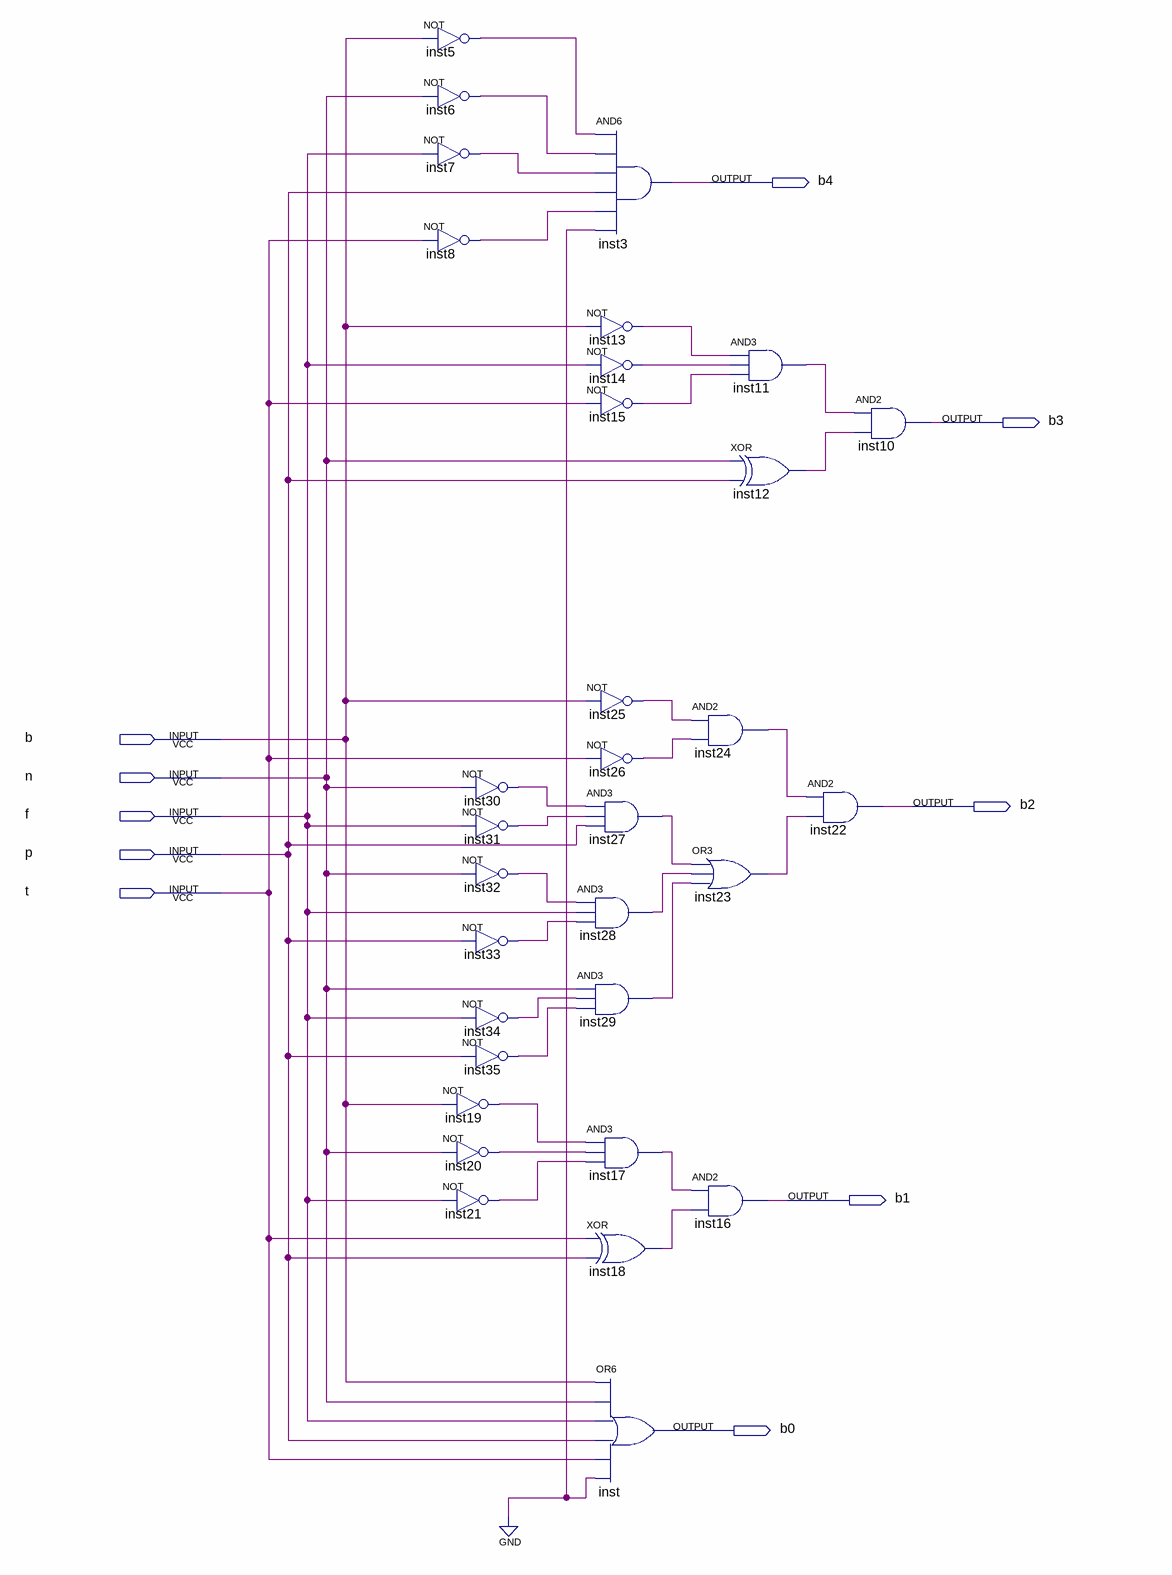
[diagram p0: schematic sheet]
// Quartus schematic Selector_7_segmentos.bdf as structural Verilog: 32 symbols, 10 pins
module Selector_7_segmentos (
  input  b,
  input  n,
  input  f,
  input  p,
  input  t,
  output b4,
  output b3,
  output b2,
  output b1,
  output b0
);

  wire inst5_out, inst6_out, inst7_out, inst8_out, inst11_out, inst12_out, inst13_out, inst14_out,
       inst15_out, inst17_out, inst18_out, inst19_out, inst20_out, inst21_out, inst23_out, inst24_out,
       inst25_out, inst26_out, inst27_out, inst28_out, inst29_out, inst30_out, inst31_out, inst32_out,
       inst33_out, inst34_out, inst35_out;

  not inst5 (inst5_out, b);
  not inst6 (inst6_out, n);
  not inst7 (inst7_out, f);
  not inst8 (inst8_out, t);
  not inst30 (inst30_out, n);
  not inst31 (inst31_out, f);
  not inst32 (inst32_out, n);
  not inst33 (inst33_out, p);
  not inst34 (inst34_out, f);
  not inst35 (inst35_out, p);
  not inst19 (inst19_out, b);
  not inst20 (inst20_out, n);
  not inst21 (inst21_out, f);
  and inst28 (inst28_out, inst32_out, f, inst33_out);
  and inst29 (inst29_out, n, inst34_out, inst35_out);
  and inst3 (b4, inst5_out, inst6_out, inst7_out, p, inst8_out, 1'b0);
  not inst13 (inst13_out, b);
  not inst14 (inst14_out, f);
  not inst15 (inst15_out, t);
  not inst25 (inst25_out, b);
  not inst26 (inst26_out, t);
  and inst27 (inst27_out, inst30_out, inst31_out, p);
  and inst17 (inst17_out, inst19_out, inst20_out, inst21_out);
  xor inst18 (inst18_out, t, p);
  or inst (b0, b, n, f, p, t, 1'b0);
  and inst11 (inst11_out, inst13_out, inst14_out, inst15_out);
  xor inst12 (inst12_out, n, p);
  and inst24 (inst24_out, inst25_out, inst26_out);
  or inst23 (inst23_out, inst27_out, inst28_out, inst29_out);
  and inst16 (b1, inst17_out, inst18_out);
  and inst22 (b2, inst24_out, inst23_out);
  and inst10 (b3, inst11_out, inst12_out);
endmodule
